# Altium schematic sheet 01.Connector.SchDoc: ARES_R06_Power
size A4; CompanyName: HIGEN; DrawnBy: 212115; Revision: V0.21; SheetNumber: 1; SheetTotal: 5; DrawingNumber: 임시도면; Rule: PcbType=ProtelPcb
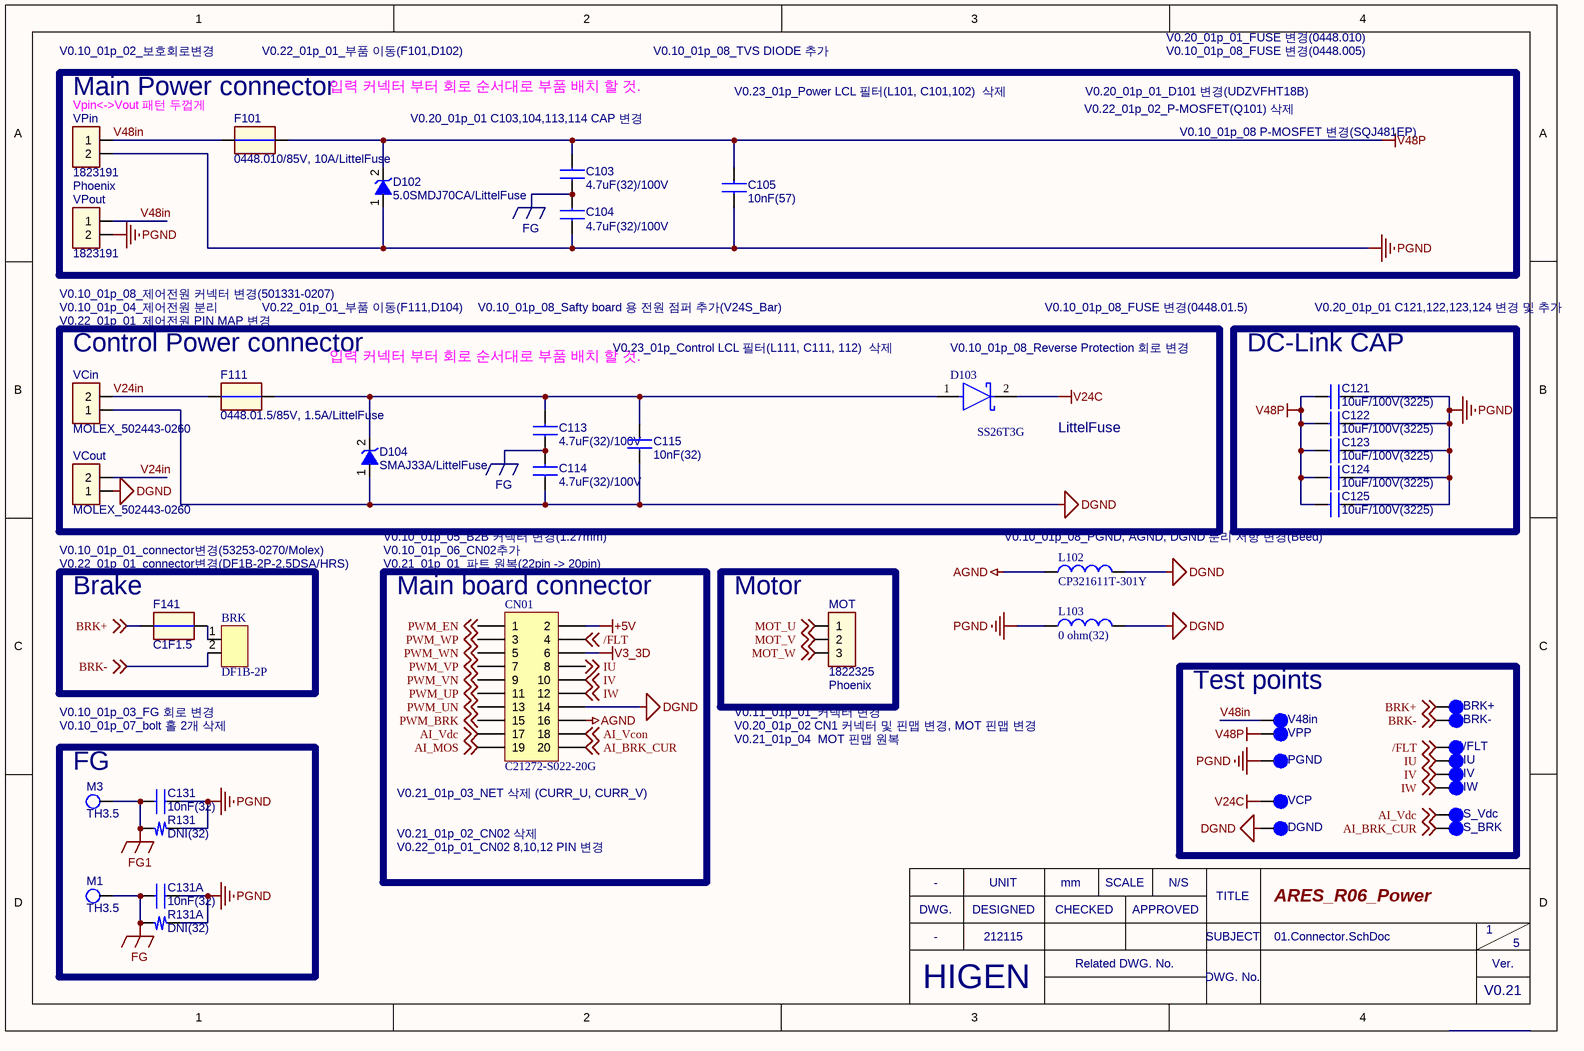
[diagram p0: 01.Connector.SchDoc]

## Parts
/FLT  TP  [TP-SMD]  (value not drawn)
BRK  DF1B-2P  [DF1B-2P-2.5DSA]
BRK+  TP  [TP-SMD]  (value not drawn)
BRK-  TP  [TP-SMD]  (value not drawn)
C103  4.7uF(32)/100V  [C-3216S]
C104  4.7uF(32)/100V  [C-3216S]
C105  10nF(57)  [C-5750]
C113  4.7uF(32)/100V  [C-3216S]
C114  4.7uF(32)/100V  [C-3216S]
C115  10nF(32)  [C-3216S]
C121  10uF/100V(3225)  [C-3225]
C122  10uF/100V(3225)  [C-3225]
C123  10uF/100V(3225)  [C-3225]
C124  10uF/100V(3225)  [C-3225]
C125  10uF/100V(3225)  [C-3225]
C131  10nF(32)  [C-3216S]
C131A  10nF(32)  [C-3216S]
CN01  C21272-S022-20G  [PH08SMD-D20P_PWR]
D102  5.0SMDJ70CA/LittelFuse  [DO-214AB]
D103  SS26T3G  [DO-214AA]  (value not drawn)
D104  SMAJ33A/LittelFuse  [SMA]
DGND  TP  [TP-SMD]  (value not drawn)
F101  0448.010/85V, 10A/LittelFuse  [0448.005]
F111  0448.01.5/85V, 1.5A/LittelFuse  [0448.005]
F141  C1F1.5  [C-3216]
IU  TP  [TP-SMD]  (value not drawn)
IV  TP  [TP-SMD]  (value not drawn)
IW  TP  [TP-SMD]  (value not drawn)
L102  CP321611T-301Y  [L-3216]
L103  0 ohm(32)  [L-3216]
M1  TH3.5  [MH-3.5MM]
M3  TH3.5  [MH-3.5MM]
MOT  1822325  [1823191-3P]
PGND  TP  [TP-SMD]  (value not drawn)
R131  DNI(32)  [R-3216S]
R131A  DNI(32)  [R-3216S]
S_BRK  TP  [TP-SMD]  (value not drawn)
S_Vdc  TP  [TP-SMD]  (value not drawn)
V48in  TP  [TP-SMD]  (value not drawn)
VCin  MOLEX_502443-0260  [MOLEX_502443-0260]
VCout  MOLEX_502443-0260  [MOLEX_502443-0260]
VCP  TP  [TP-SMD]  (value not drawn)
VPin  1823191  [1823191-2P]
VPout  1823191  [1823191-2P]
VPP  TP  [TP-SMD]  (value not drawn)

## Blocks framed on the sheet
Main Power connector: C103-C105 D102 F101 VPin VPout
Control Power connector: C113-C115 D103 D104 F111 VCin VCout
DC-Link CAP: C121-C125
Brake: BRK F141
Main board connector: CN01
Motor: MOT
Test points: /FLT BRK+ BRK- DGND IU IV IW PGND S_BRK S_Vdc V48in VCP VPP
FG: C131 C131A M1 M3 R131 R131A

## Nets
+5V: CN01.2
AGND: CN01.16 L102.1
DGND: C114.1 C115.1 CN01.14 D104.1(A) DGND.1 L102.2 L103.2 VCin.1 VCout.1
FG: C103.1 C104.2 C113.1 C114.2 C131A.1 M1.1(TP) R131A.1(P1)
FG1: C131.1 M3.1(TP) R131.1(P1)
PGND: C104.1 C105.1 C121.2 C122.2 C123.2 C124.2 C125.2 C131.2 C131A.2 D102.1(A) L103.1 PGND.1 R131.2(P2) R131A.2(P2) VPin.2 VPout.2
V3_3D: CN01.6
V24C: D103.2(C) VCP.1
V48P: C103.2 C105.2 C121.1 C122.1 C123.1 C124.1 C125.1 D102.2(K) F101.2 VPP.1
/FLT: /FLT.1 CN01.4 ; off-sheet /FLT
AI_BRK_CUR: CN01.20 S_BRK.1 ; off-sheet AI_BRK_CUR
AI_MOS: CN01.19 ; off-sheet AI_MOS
AI_Vcon: CN01.18 ; off-sheet AI_Vcon
AI_Vdc: CN01.17 S_Vdc.1 ; off-sheet AI_Vdc
BRK+: BRK+.1 F141.2 ; off-sheet BRK+
BRK-: BRK.2 BRK-.1 ; off-sheet BRK-
IU: CN01.8 IU.1 ; off-sheet IU
IV: CN01.10 IV.1 ; off-sheet IV
IW: CN01.12 IW.1 ; off-sheet IW
MOT_U: MOT.1 ; off-sheet MOT_U
MOT_V: MOT.2 ; off-sheet MOT_V
MOT_W: MOT.3 ; off-sheet MOT_W
PWM_BRK: CN01.15 ; off-sheet PWM_BRK
PWM_EN: CN01.1 ; off-sheet PWM_EN
PWM_UN: CN01.13 ; off-sheet PWM_UN
PWM_UP: CN01.11 ; off-sheet PWM_UP
PWM_VN: CN01.9 ; off-sheet PWM_VN
PWM_VP: CN01.7 ; off-sheet PWM_VP
PWM_WN: CN01.5 ; off-sheet PWM_WN
PWM_WP: CN01.3 ; off-sheet PWM_WP
V24in: F111.1 VCin.2 VCout.2
V48in: F101.1 V48in.1 VPin.1 VPout.1
NetBRK_1: BRK.1 F141.1
NetC113_2: C113.2 C115.2 D103.1(A) D104.2(K) F111.2

## Notes on the sheet
- V0.20_01p_01_FUSE 변경(0448.010)
- V0.10_01p_02_보호회로변경
- (near VPin) Vpin<->Vout 패턴 두껍게
- V0.22_01p_01_부품 이동(F101,D102)
- 입력 커넥터 부터 회로 순서대로 부품 배치 할 것.
- V0.10_01p_08_TVS DIODE 추가
- V0.23_01p_Power LCL 필터(L101, C101,102)  삭제
- V0.22_01p_02_P-MOSFET(Q101) 삭제
- V0.20_01p_01_D101 변경(UDZVFHT18B)
- V0.10_01p_08_FUSE 변경(0448.005)
- V0.20_01p_01 C103,104,113,114 CAP 변경
- V0.10_01p_08 P-MOSFET 변경(SQJ481EP)
- Phoenix
- V0.10_01p_04_제어전원 분리
- V0.10_01p_08_제어전원 커넥터 변경(501331-0207)
- V0.22_01p_01_부품 이동(F111,D104)
- V0.10_01p_08_Safty board 용 전원 점퍼 추가(V24S_Bar)
- V0.10_01p_08_FUSE 변경(0448.01.5)
- V0.20_01p_01 C121,122,123,124 변경 및 추가
- V0.22_01p_01_제어전원 PIN MAP 변경
- V0.23_01p_Control LCL 필터(L111, C111, 112)  삭제
- (near D103) V0.10_01p_08_Reverse Protection 회로 변경
- LittelFuse
- V0.10_01p_01_connector변경(53253-0270/Molex)
- V0.22_01p_01_connector변경(DF1B-2P-2.5DSA/HRS)
- V0.10_01p_05_B2B 커넥터 변경(1.27mm)
- V0.10_01p_06_CN02추가
- V0.21_01p_01_파트 원복(22pin -> 20pin)
- (near L102) V0.10_01p_08_PGND, AGND, DGND 분리 저항 변경(Beed)
- V0.10_01p_03_FG 회로 변경
- V0.11_01p_01_커넥터 변경
- (near MOT) Phoenix
- V0.10_01p_07_bolt 홀 2개 삭제
- V0.20_01p_02 CN1 커넥터 및 핀맵 변경, MOT 핀맵 변경
- V0.21_01p_04  MOT 핀맵 원복
- (near CN01) V0.21_01p_03_NET 삭제 (CURR_U, CURR_V)
- V0.21_01p_02_CN02 삭제
- V0.22_01p_01_CN02 8,10,12 PIN 변경
- -
- DWG.
- UNIT
- DESIGNED
- mm
- CHECKED
- SCALE
- APPROVED
- N/S
- TITLE
- HIGEN
- Related DWG. No.
- SUBJECT
- DWG. No.
- Ver.

## Library data of the parts
/FLT BRK+ BRK- DGND IU IV IW PGND S_BRK S_Vdc V48in VCP VPP = 2H_TestPointThroughHole
BRK = Component_1
C103-C105 C113-C115 C121-C125 C131 C131A = CAP_NP
CN01 = Header 10X2: Header, 10-Pin, Dual row; LatestRevisionDate: 17-Jul-2002; LatestRevisionNote: Re-released for DXP Platform.; Publisher: Altium Limited
D102 D104 = Diode_TVS
D103 = SS26T3G: DIODE SCHOTTKY 60V 2A SMB; 3DS Part Number: 417-00001; Manufacturer: ON Semi; Capacitance: SKIP; Library Path1: parts/Diode_ON_Semi_SS26T3G_eec.SchLib; Max Junction Temp: +150°C; Max Surge Forward Current: 40A; Peak Reverse Current: 0.2mA; Standoff Height: 0.05mm; Value: SKIP; Verification Version: 0.0.0.1; Part Number: SS26T3G; Datasheet Path: datasheets/Diode_ON_Semi_SS26T3G_eec.pdf; ComponentLink1Description: Upverter; ComponentLink1URL: https://upverter.com/upn/revision/e2f486cca74213e5/; ComponentLink2Description: Datasheet; ComponentLink2URL: http://www.onsemi.cn/PowerSolutions/document/SS26-D.PDF; Datasheet Path1: datasheets/Diode_ON_Semi_SS26T3G_eec.pdf; Dc Blocking Voltage: 60V; Digikey Description: DIODE SCHOTTKY 60V 2A SMB; Digikey Part Number: SS26T3GOSCT-ND; Footprint Url: http://www.onsemi.com/pub/Collateral/403A-03.PDF; Forward Current: 2A; Height: 2.47mm; Inductance: SKIP; Lead Free: yes; Library Ref1: SS26T3G; Max Repetitive Reverse Voltage: 60V; Mouser Description: SMB Power Surface Mount Package employing the Schottky Barrier principle in a metal-to-silicon power rectifier.; Mouser Part Number: 863-SS26T3G; Package: 403A-03; Price: 0.196415605484; Resistance: SKIP; RoHS: TRUE; Supplier 1: Digi-Key; Supplier 2: Mouser; Supplier Part Number 1: SS26T3GOSCT-ND; Supplier Part Number 2: 863-SS26T3G; Temperature: -55°C to +150°C; Temperature Range High: +150°C; Temperature Range Low: -55°C; Voltage: SKIP; Working Reverse Voltage: 60V; helpURL: https://upverter.com/upn/revision/e2f486cca74213e5/
F101 F111 F141 = Fuse
L102 = Inductor: Code_IEC: 1005; Published: 8-Jun-2000; LatestRevisionDate: 29-May-2009; LatestRevisionNote: IPC-7351 Footprint Added.; PackageReference: 0402-A; Publisher: Altium Limited; PackageDescription: Chip Inductor; Code_JEITA: 0402
L103 = Inductor: Code_IEC: 1005; Value: CP321611T-301Y; Published: 8-Jun-2000; LatestRevisionDate: 29-May-2009; LatestRevisionNote: IPC-7351 Footprint Added.; PackageReference: 0402-A; Publisher: Altium Limited; PackageDescription: Chip Inductor; Code_JEITA: 0402
M1 M3 = ThroughHole
MOT = Connector_1x3
R131 R131A = Res
VCin VCout VPin VPout = Connector_1x2